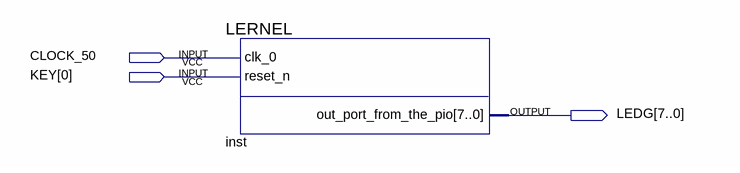
[diagram p0: schematic sheet]
// Quartus schematic led_soft.bdf as structural Verilog: 1 symbols, 3 pins
module led_soft (
  input  CLOCK_50,
  input  [0:0] KEY,
  output [7:0] LEDG
);

  LERNEL inst (.clk_0(CLOCK_50), .reset_n(KEY[0]), .out_port_from_the_pio(LEDG));
endmodule
